# Altium schematic sheet [03] - BLOCK DIAGRAM.SchDoc: Test title
size A4; PageSetup: Record=PageOptions|CenterHorizontal=True|CenterVertical=True|PrintScale=0.52|XCorrection=1.00|YCorrection=1.00|PrintKind=1|BorderSize=5000000|LeftOffset=0|BottomOffset=0|Orientation=2|PaperLength=1000|PaperWidth=1000|Scale=100|PaperSource=4|PrintQuality=600|MediaType=1|DitherType=10|PrintScaleMode=1|PaperKind=A4|PaperIndex=9; Projectnumber: OWN-000; Project name:: Test name; Client: DSG; Date: YYYY-MM-DD; CheckedBy: Bartosz Kowierski; DrawnBy: Paweł Poryzała; Engineer: X; Revision: 0.9; Size: A4; Contact: datasystem.pl
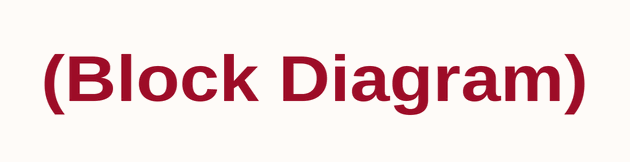
[diagram p0: [03] - BLOCK DIAGRAM.SchDoc]

## Notes on the sheet
- (Block Diagram)
- REV:
- A  P  P  R  O  V  E  D
- /
- Lodz University of Technology
- ul. Wolczanska 211/215
- 90-924 LODZ, POLAND
- Institute of Electronics
- Project name:
- Title:
- Author:
- Verified by: